# Altium schematic sheet Connectors.SchDoc
size Letter
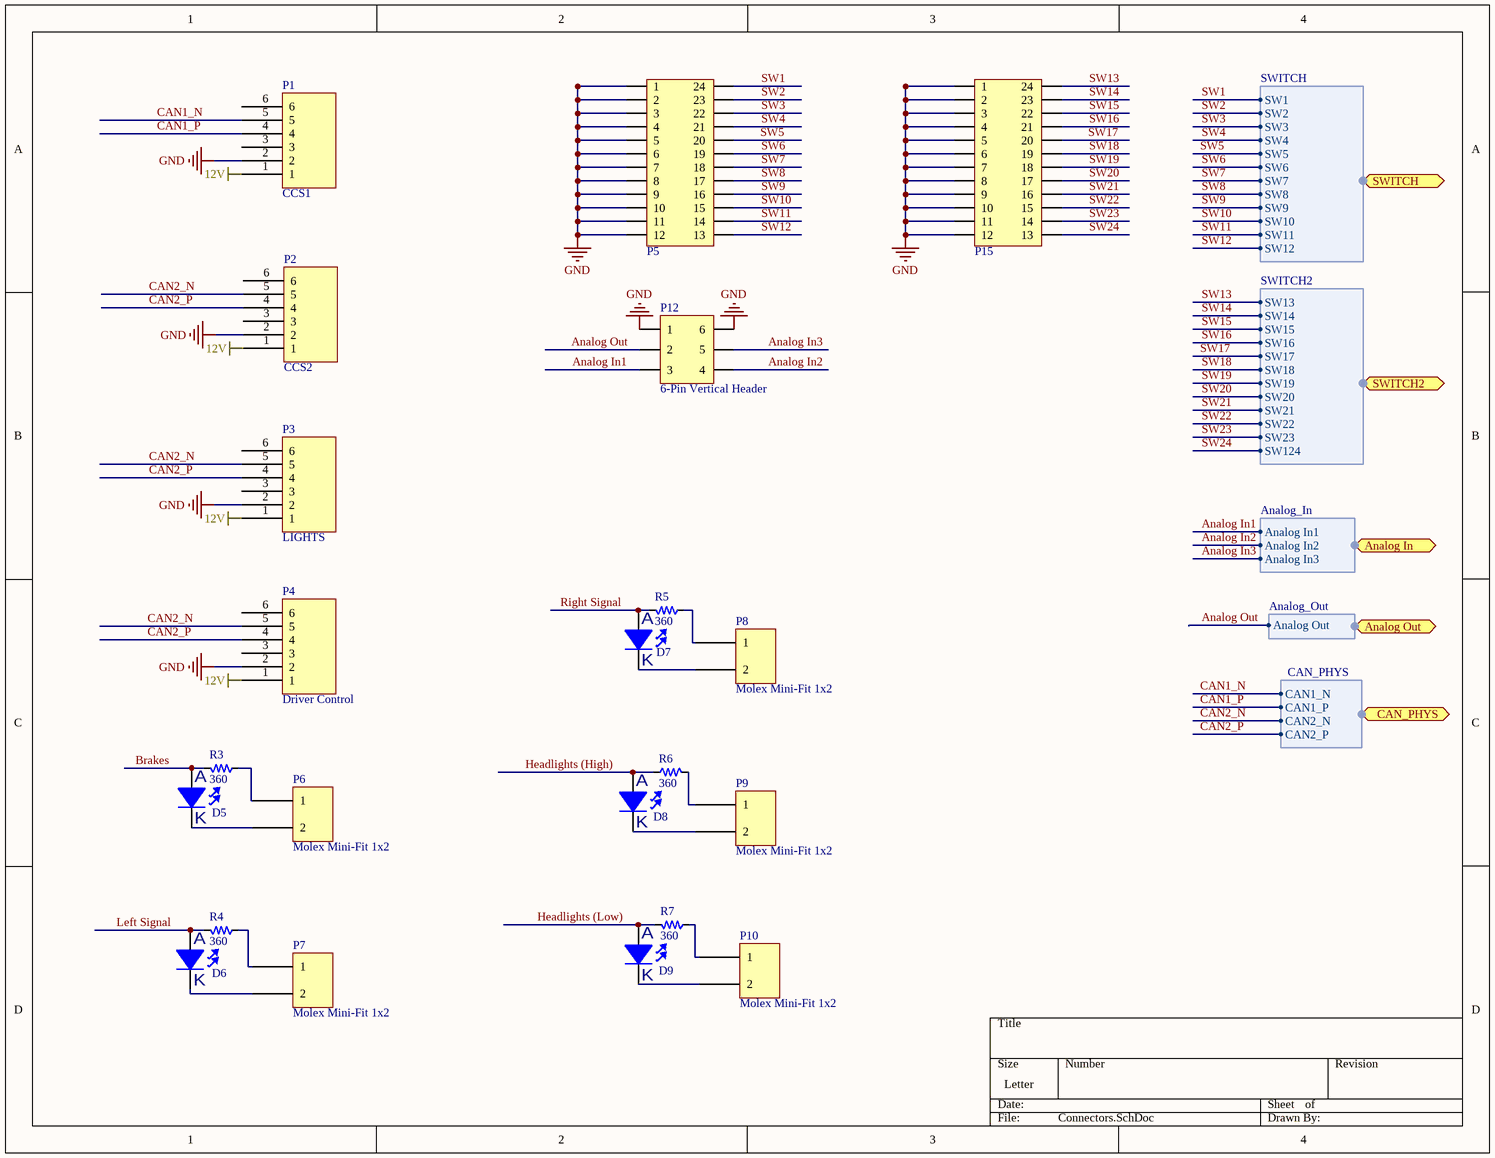
[diagram p0: Connectors.SchDoc]

## Parts
D5  LED RED  [RED LED]  (value not drawn)
D6  LED RED  [RED LED]  (value not drawn)
D7  LED RED  [RED LED]  (value not drawn)
D8  LED RED  [RED LED]  (value not drawn)
D9  LED RED  [RED LED]  (value not drawn)
P1  CCS1  [PCB_MLX_MICROFIT_3X2]
P2  CCS2  [PCB_MLX_MICROFIT_3X2]
P3  LIGHTS  [PCB_MLX_MICROFIT_3X2]
P4  Driver Control  [PCB_MLX_MICROFIT_3X2]
P5  24-Pin Vertical Header  [24-Pin Vertical Header]  (value not drawn)
P6  Molex Mini-Fit 1x2  [Molex Mini-Fit Jr 2x1]
P7  Molex Mini-Fit 1x2  [Molex Mini-Fit Jr 2x1]
P8  Molex Mini-Fit 1x2  [Molex Mini-Fit Jr 2x1]
P9  Molex Mini-Fit 1x2  [Molex Mini-Fit Jr 2x1]
P10  Molex Mini-Fit 1x2  [Molex Mini-Fit Jr 2x1]
P12  6-Pin Vertical Header  [6-Pin Vertical Header]
P15  24-Pin Vertical Header  [24-Pin Vertical Header]  (value not drawn)
R3  Resistance: 360  [PCB_GENERIC_SMD_0603]  (hidden comment: SCH_GENERIC_RESISTOR_0603)
R4  Resistance: 360  [PCB_GENERIC_SMD_0603]  (hidden comment: SCH_GENERIC_RESISTOR_0603)
R5  Resistance: 360  [PCB_GENERIC_SMD_0603]  (hidden comment: SCH_GENERIC_RESISTOR_0603)
R6  Resistance: 360  [PCB_GENERIC_SMD_0603]  (hidden comment: SCH_GENERIC_RESISTOR_0603)
R7  Resistance: 360  [PCB_GENERIC_SMD_0603]  (hidden comment: SCH_GENERIC_RESISTOR_0603)

## Ports
Analog In (harness Analog_In), Analog Out (harness Analog_Out), CAN_PHYS (harness CAN_PHYS), SWITCH2 (harness SWITCH2), SWITCH (harness SWITCH)

## Harnesses
SWITCH: SW1, SW2, SW3, SW4, SW5, SW6, SW7, SW8, SW9, SW10, SW11, SW12
Analog_In: Analog In1, Analog In2, Analog In3
Analog_Out: Analog Out
CAN_PHYS: CAN1_N, CAN1_P, CAN2_N, CAN2_P
SWITCH2: SW13, SW14, SW15, SW16, SW17, SW18, SW19, SW20, SW21, SW22, SW23, SW124

## Nets
12V: P1.1 P2.1 P3.1 P4.1
GND: P1.2 P2.2 P3.2 P4.2 P5.1 P5.2 P5.3 P5.4 P5.5 P5.6 P5.7 P5.8 P5.9 P5.10 P5.11 P5.12 P12.1 P12.6 P15.1 P15.2 P15.3 P15.4 P15.5 P15.6 P15.7 P15.8 P15.9 P15.10 P15.11 P15.12
Analog In1: P12.3 ; port Analog In.Analog In1
Analog In2: P12.4 ; port Analog In.Analog In2
Analog In3: P12.5 ; port Analog In.Analog In3
Analog Out: P12.2 ; port Analog Out.Analog Out
Brakes: D5.2 R3.2
CAN1_N: P1.5 ; port CAN_PHYS.CAN1_N
CAN1_P: P1.4 ; port CAN_PHYS.CAN1_P
CAN2_N: P2.5 P3.5 P4.5 ; port CAN_PHYS.CAN2_N
CAN2_P: P2.4 P3.4 P4.4 ; port CAN_PHYS.CAN2_P
Headlights (High): D8.2 R6.1
Headlights (Low): D9.2 R7.2
Left Signal: D6.2 R4.2
Right Signal: D7.2 R5.2
SW1: P5.24 ; port SWITCH.SW1
SW2: P5.23 ; port SWITCH.SW2
SW3: P5.22 ; port SWITCH.SW3
SW4: P5.21 ; port SWITCH.SW4
SW5: P5.20 ; port SWITCH.SW5
SW6: P5.19 ; port SWITCH.SW6
SW7: P5.18 ; port SWITCH.SW7
SW8: P5.17 ; port SWITCH.SW8
SW9: P5.16 ; port SWITCH.SW9
SW10: P5.15 ; port SWITCH.SW10
SW11: P5.14 ; port SWITCH.SW11
SW12: P5.13 ; port SWITCH.SW12
SW13: P15.24 ; port SWITCH2.SW13
SW14: P15.23 ; port SWITCH2.SW14
SW15: P15.22 ; port SWITCH2.SW15
SW16: P15.21 ; port SWITCH2.SW16
SW17: P15.20 ; port SWITCH2.SW17
SW18: P15.19 ; port SWITCH2.SW18
SW19: P15.18 ; port SWITCH2.SW19
SW20: P15.17 ; port SWITCH2.SW20
SW21: P15.16 ; port SWITCH2.SW21
SW22: P15.15 ; port SWITCH2.SW22
SW23: P15.14 ; port SWITCH2.SW23
SW24: P15.13 ; port SWITCH2.SW124
NetD5_1: D5.1 P6.2
NetD6_1: D6.1 P7.2
NetD7_1: D7.1 P8.2
NetD8_1: D8.1 P9.2
NetD9_1: D9.1 P10.2
NetP6_1: P6.1 R3.1
NetP7_1: P7.1 R4.1
NetP8_1: P8.1 R5.1
NetP9_1: P9.1 R6.2
NetP10_1: P10.1 R7.1

Not connected (* = marked no-connect by the designer): P1 3 6; P2 3 6; P3 3 6; P4 3 6

## Notes on the sheet
- (in symbol LED RED) A; K

## Library data of the parts
P1-P4 = SCH_MLX_MICROFIT_3X2
P5 P15 = 24-Pin Vertical Header: Manufacturer: Sullins; Manufacturer No.: PPPC132LFBN-RC
P12 = 6-Pin Vertical Header: Manufacturer: Sullins; Manufacturer ID: PPPC032LFBN-RC
R3-R7 = SCH_GENERIC_RESISTOR_0603: Generic SMD resistor 0603